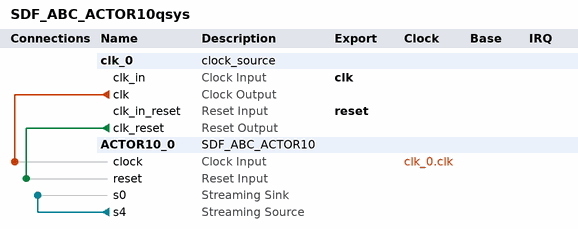
[diagram p0: system contents]
# Platform Designer (Qsys) system SDF_ABC_ACTOR10qsys, Cyclone V 5CSEBA6U23I7
# Parameters at their usual value, and those the tool derives, are not listed.
package require -exact qsys 22.1
create_system SDF_ABC_ACTOR10qsys
set_project_property DEVICE_FAMILY {Cyclone V}
set_project_property DEVICE 5CSEBA6U23I7

add_instance clk_0 clock_source 22.1
set_instance_parameter_value clk_0 clockFrequency 50000000

add_instance ACTOR10_0 SDF_ABC_ACTOR10 1.0

# connections
add_connection clk_0.clk ACTOR10_0.clock clock
add_connection clk_0.clk_reset ACTOR10_0.reset reset
add_connection ACTOR10_0.s4 ACTOR10_0.s0 avalon_streaming

# exported interfaces
add_interface clk clock sink
set_interface_property clk EXPORT_OF clk_0.clk_in
add_interface reset reset sink
set_interface_property reset EXPORT_OF clk_0.clk_in_reset

set_interconnect_requirement {$system} qsys_mm.clockCrossingAdapter HANDSHAKE
set_interconnect_requirement {$system} qsys_mm.enableEccProtection FALSE
set_interconnect_requirement {$system} qsys_mm.insertDefaultSlave FALSE
set_interconnect_requirement {$system} qsys_mm.maxAdditionalLatency 1

save_system SDF_ABC_ACTOR10qsys.qsys
